# EAGLE design gimbal_controller (EAGLE 7.4.0)
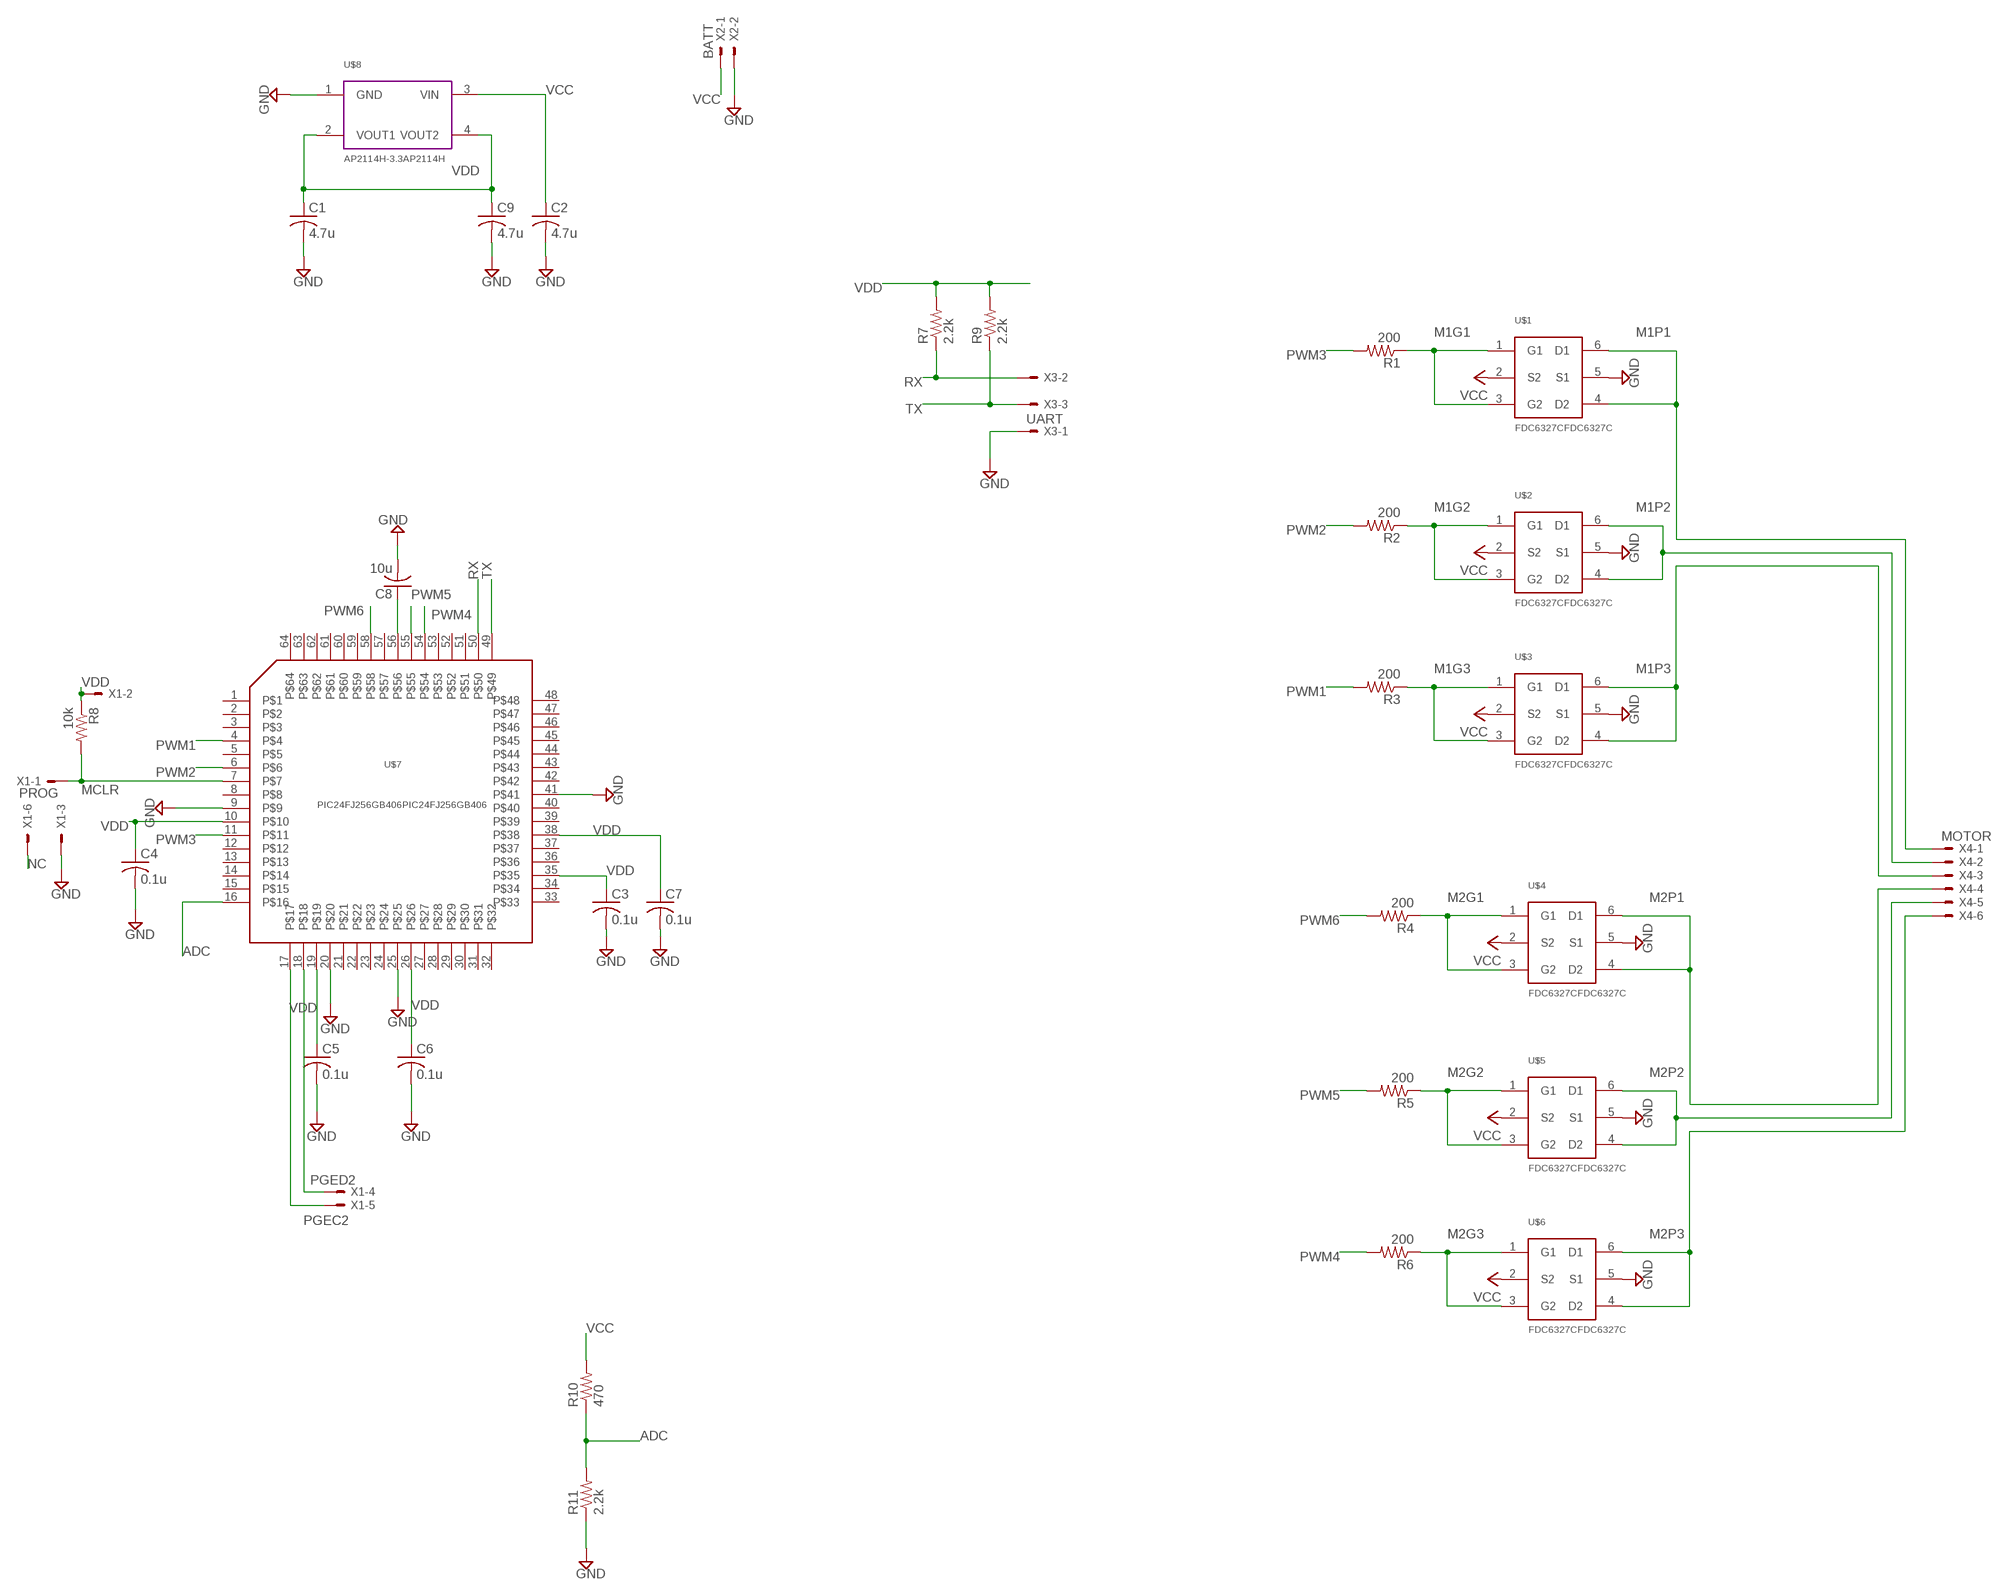
[diagram p0: schematic, sheet 1]

## Parts
C1  4.7u  C-USC0805  [C0805]
C2  4.7u  C-USC0805  [C0805]
C3  0.1u  C-USC0805  [C0805]
C4  0.1u  C-USC0805  [C0805]
C5  0.1u  C-USC0805  [C0805]
C6  0.1u  C-USC0805  [C0805]
C7  0.1u  C-USC0805  [C0805]
C8  10u  C-USC0805  [C0805]
C9  4.7u  C-USC0805  [C0805]
R1  200  R-US_R0805  [R0805]
R2  200  R-US_R0805  [R0805]
R3  200  R-US_R0805  [R0805]
R4  200  R-US_R0805  [R0805]
R5  200  R-US_R0805  [R0805]
R6  200  R-US_R0805  [R0805]
R7  2.2k  R-US_R0805  [R0805]
R8  10k  R-US_R0805  [R0805]
R9  2.2k  R-US_R0805  [R0805]
R10  470  R-US_R0805  [R0805]
R11  2.2k  R-US_R0805  [R0805]
U$1  FDC6327CFDC6327C  [SSOT6]
U$2  FDC6327CFDC6327C  [SSOT6]
U$3  FDC6327CFDC6327C  [SSOT6]
U$4  FDC6327CFDC6327C  [SSOT6]
U$5  FDC6327CFDC6327C  [SSOT6]
U$6  FDC6327CFDC6327C  [SSOT6]
U$7  PIC24FJ256GB406PIC24FJ256GB406  [TQFP64-10X10]
U$8  AP2114H-3.3AP2114H  [SOT223]
X1  PROG  22-23-2061  [22-23-2061]
X2  BATT  22-23-2021  [22-23-2021]
X3  UART  22-23-2031  [22-23-2031]
X4  MOTOR  22-23-2061  [22-23-2061]

## Nets
ADC: R10.1 R11.2 U$7.16
GND: C1.2 C2.2 C3.2 C4.2 C5.2 C6.2 C7.2 C8.2 C9.2 R11.1 U$1.5(S1) U$2.5(S1) U$3.5(S1) U$4.5(S1) U$5.5(S1) U$6.5(S1) U$7.9 U$7.20 U$7.25 U$7.41 U$8.1(GND) X1.3 X2.2 X3.1
M1G1: R1.1 U$1.1(G1) U$1.3(G2)
M1G2: R2.1 U$2.1(G1) U$2.3(G2)
M1G3: R3.1 U$3.1(G1) U$3.3(G2)
M1P1: U$1.4(D2) U$1.6(D1) X4.1
M1P2: U$2.4(D2) U$2.6(D1) X4.2
M1P3: U$3.4(D2) U$3.6(D1) X4.3
M2G1: R4.1 U$4.1(G1) U$4.3(G2)
M2G2: R5.1 U$5.1(G1) U$5.3(G2)
M2G3: R6.1 U$6.1(G1) U$6.3(G2)
M2P1: U$4.4(D2) U$4.6(D1) X4.4
M2P2: U$5.4(D2) U$5.6(D1) X4.5
M2P3: U$6.4(D2) U$6.6(D1) X4.6
MCLR: R8.2 U$7.7 X1.1
N$3: C8.1 U$7.56
NC: X1.6
PGEC2: U$7.17 X1.5
PGED2: U$7.18 X1.4
PWM1: R3.2 U$7.4
PWM2: R2.2 U$7.6
PWM3: R1.2 U$7.11
PWM4: R6.2 U$7.54
PWM5: R5.2 U$7.55
PWM6: R4.2 U$7.58
RX: R7.1 U$7.50 X3.2
TX: R9.1 U$7.49 X3.3
VCC: C2.1 R10.2 U$1.2(S2) U$2.2(S2) U$3.2(S2) U$4.2(S2) U$5.2(S2) U$6.2(S2) U$8.3(VIN) X2.1
VDD: C1.1 C3.1 C4.1 C5.1 C6.1 C7.1 C9.1 R7.2 R8.1 R9.2 U$7.10 U$7.19 U$7.26 U$7.35 U$7.38 U$8.2(VOUT1) U$8.4(VOUT2) X1.2
Unconnected: U$7.1 U$7.2 U$7.3 U$7.5 U$7.8 U$7.12 U$7.13 U$7.14 U$7.15 U$7.21 U$7.22 U$7.23 U$7.24 U$7.27 U$7.28 U$7.29 U$7.30 U$7.31 U$7.32 U$7.33 U$7.34 U$7.36 U$7.37 U$7.39 U$7.40 U$7.42 U$7.43 U$7.44 U$7.45 U$7.46 U$7.47 U$7.48 U$7.51 U$7.52 U$7.53 U$7.57 U$7.59 U$7.60 U$7.61 U$7.62 U$7.63 U$7.64

## Library data of the parts
C1-C9 = resistor:C-US: CAPACITOR, American symbol
R1-R6 R8 = rcl:R-US_: RESISTOR, American symbol
R7 R9-R11 = resistor:R-US_: RESISTOR, American symbol
U$1-U$6 = transistors:FDC6327C: MOSFET N/P HALFBRIDGE; DIGIKEY_PARTNO: FDC6327CCT-ND
U$7 = mcu:PIC24FJ256GB406; DIGIKEY_PARTNO: PIC24FJ256GB406-I/PT-ND
U$8 = power:AP2114H-3.3: IC REG LDO 3.3V 1A SOT223; DIGIKEY_PARTNO: AP2114H-3.3TRG1DICT-ND
X1 X4 = con-molex:22-23-2061: .100" (2.54mm) Center Header - 6 Pin; MF: MOLEX; MPN: 22-23-2061; OC_FARNELL: 1462922; OC_NEWARK: 27C1933
X2 = con-molex:22-23-2021: .100" (2.54mm) Center Header - 2 Pin; MF: MOLEX; MPN: 22-23-2021; OC_FARNELL: 1462926; OC_NEWARK: 25C3832
X3 = con-molex:22-23-2031: .100" (2.54mm) Center Header - 3 Pin; MF: MOLEX; MPN: 22-23-2031; OC_FARNELL: 1462950; OC_NEWARK: 30C0862

## Board
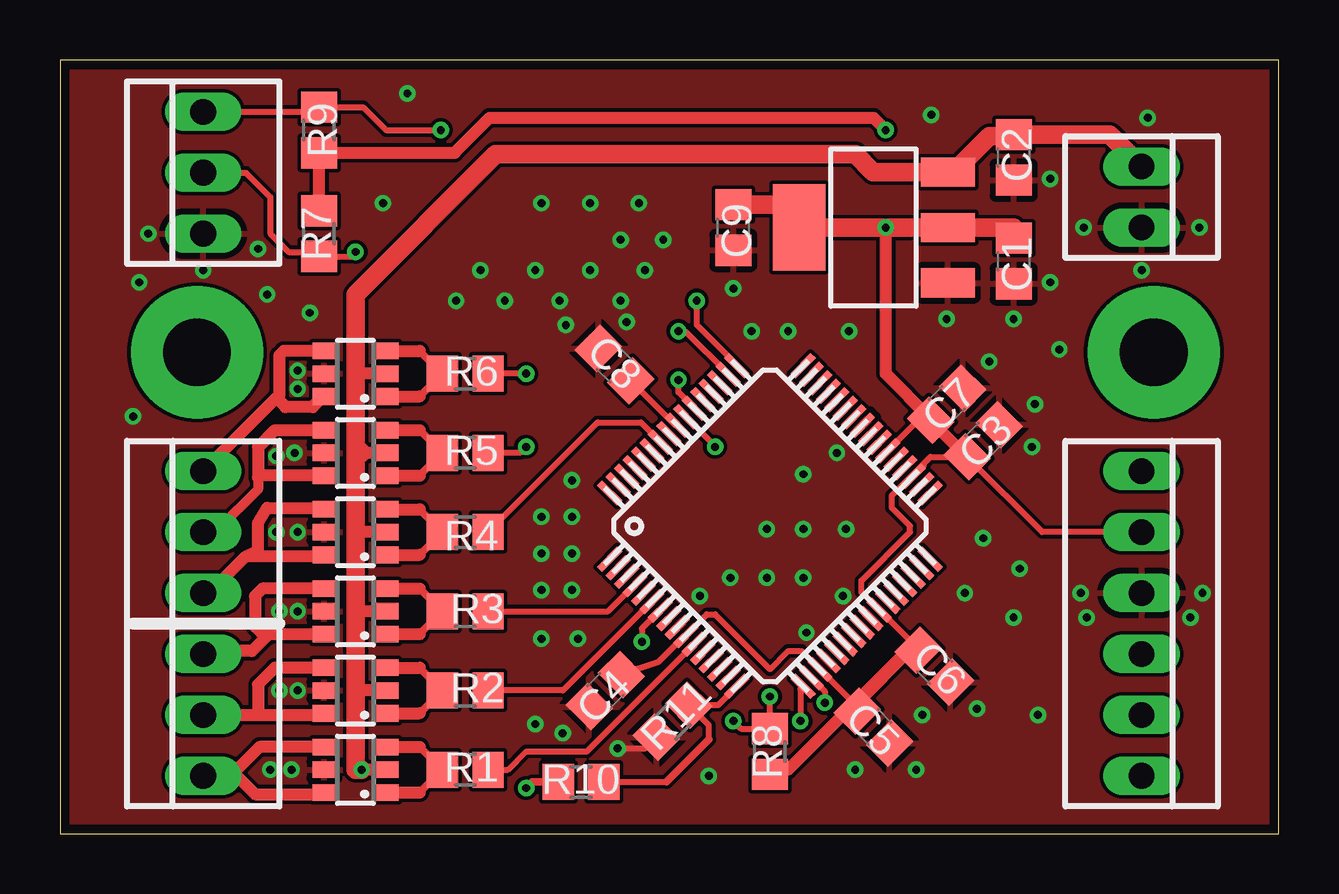
[diagram p1: board, top side]
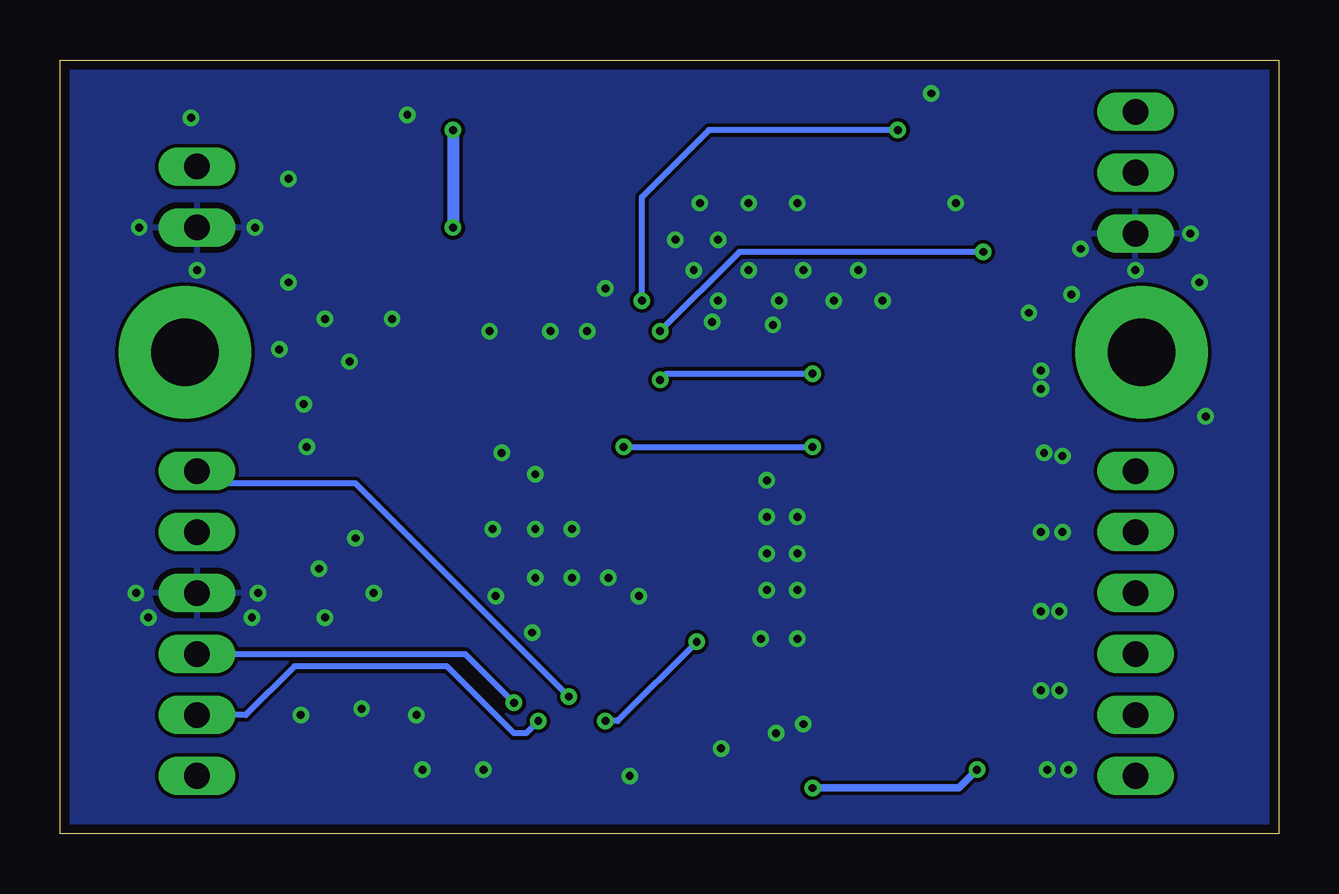
[diagram p2: board, bottom side, seen from below]

Size 50.8 x 32.26 mm. Coordinates in mm from the lower left corner, seen from the top.
Outline: 0,0 50.8,0 50.8,32.26 0,32.26 0,0
Copper layers (1*16): Top 0.0356mm / dielectric 1.5011mm / Bottom 0.0356mm
Design rules "LaenPCBOrder": minimum track width 6mil, minimum drill 13mil, track to track 6mil, track to pad 6mil, pad to pad 6mil, via to via 6mil, smd to smd 6mil, copper to edge 15mil, drill to drill 6mil, minimum pad ring 7mil, minimum via ring 7mil, stop-mask expansion 3mil, vias tented up to drill 0mil, thermal gap 10mil

### Footprints (pad centres in the part's own frame; a part is rotated, then mirrored left to right if it is on the bottom)
C0805 = smd 1.3 x 1.5: 1 -0.95,0; 2 0.95,0
R0805 = smd 1.3 x 1.5: 1 -0.95,0; 2 0.95,0
SSOT6 = smd 0.69 x 0.99: 1 -0.95,-1.3; 2 0,-1.3; 3 0.95,-1.3; 4 0.95,1.3; 5 0,1.3; 6 -0.95,1.3
TQFP64-10X10 = smd 1.2 x 0.3: 1 -5.7,3.75; 2 -5.7,3.25; 3 -5.7,2.75; 4 -5.7,2.25; 5 -5.7,1.75; 6 -5.7,1.25; 7 -5.7,0.75; 8 -5.7,0.25; 9 -5.7,-0.25; 10 -5.7,-0.75; 11 -5.7,-1.25; 12 -5.7,-1.75; 13 -5.7,-2.25; 14 -5.7,-2.75; 15 -5.7,-3.25; 16 -5.7,-3.75; 33 5.7,-3.75; 34 5.7,-3.25; 35 5.7,-2.75; 36 5.7,-2.25; 37 5.7,-1.75; 38 5.7,-1.25; 39 5.7,-0.75; 40 5.7,-0.25; 41 5.7,0.25; 42 5.7,0.75; 43 5.7,1.25; 44 5.7,1.75; 45 5.7,2.25; 46 5.7,2.75; 47 5.7,3.25; 48 5.7,3.75 | smd 0.3 x 1.2: 17 -3.75,-5.7; 18 -3.25,-5.7; 19 -2.75,-5.7; 20 -2.25,-5.7; 21 -1.75,-5.7; 22 -1.25,-5.7; 23 -0.75,-5.7; 24 -0.25,-5.7; 25 0.25,-5.7; 26 0.75,-5.7; 27 1.25,-5.7; 28 1.75,-5.7; 29 2.25,-5.7; 30 2.75,-5.7; 31 3.25,-5.7; 32 3.75,-5.7; 49 3.75,5.7; 50 3.25,5.7; 51 2.75,5.7; 52 2.25,5.7; 53 1.75,5.7; 54 1.25,5.7; 55 0.75,5.7; 56 0.25,5.7; 57 -0.25,5.7; 58 -0.75,5.7; 59 -1.25,5.7; 60 -1.75,5.7; 61 -2.25,5.7; 62 -2.75,5.7; 63 -3.25,5.7; 64 -3.75,5.7
SOT223 = smd 1.219 x 2.235: 1 -2.311,-3.099; 2 0,-3.099; 3 2.311,-3.099 | smd 3.6 x 2.2: 4 0,3.099
22-23-2061 = drill 1.067 long: 1 -6.35,0; 2 -3.81,0; 3 -1.27,0; 4 1.27,0; 5 3.81,0; 6 6.35,0
22-23-2021 = drill 1.067 long: 1 -1.27,0; 2 1.27,0
22-23-2031 = drill 1.067 long: 1 -2.54,0; 2 0,0; 3 2.54,0

### Placement (x,y rotation side)
C1  39.75,23.88 270 top
C2  39.75,28.19 270 top
C3  38.48,16.38 45 top
C4  22.73,5.97 225 top
C5  33.91,4.45 315 top
C6  36.45,6.99 315 top
C7  36.96,17.91 45 top
C8  23.11,19.56 135 top
C9  28.07,25.27 270 top
R1  16.89,2.67 0 top
R2  16.89,5.97 0 top
R3  16.89,9.27 0 top
R4  16.89,12.57 0 top
R5  16.89,15.88 0 top
R6  16.89,19.18 0 top
R7  10.79,25.02 90 top
R8  29.59,3.43 90 top
R9  10.79,29.34 270 top
R10  21.72,2.16 180 top
R11  25.53,4.7 45 top
U$1  12.32,2.67 90 top
U$2  12.32,5.97 90 top
U$3  12.32,9.27 90 top
U$4  12.32,12.57 90 top
U$5  12.32,15.88 90 top
U$6  12.32,19.18 90 top
U$7  29.59,12.83 45 top
U$8  33.91,25.27 90 top
X1  45.09,8.76 270 top
X2  45.09,26.54 270 top
X3  5.97,27.56 90 top
X4  5.97,8.76 90 top

### Tracks (layer width: path | path; a pad name or v marks a point on that pad's centre or on a via)
ADC
  Top 0.254: R10.1 25.27,2.16 | 27.05,3.94 27.05,4.52 R11.2 27.44,5.37 U$7.16
  Top 0.305: 25.27,2.16 27.05,3.94
GND  (via drill 0.33, 0.33 pad 0.3)
  Top 0.254: v23.24,3.56 24.38,3.56 R11.1
  other vias: 40.51,16.13 38.73,19.68 32.38,15.88 20.95,4.19 35.69,2.67 38.23,5.21 21.08,21.21 23.62,21.34 9.91,19.3 9.91,18.54 9.02,15.75 9.78,15.88 9.02,12.57 9.91,12.57 8.76,2.67 9.65,2.67 9.14,5.97 9.91,5.97 9.14,9.27 9.91,9.27 40.64,17.91 42.55,10.03 42.8,9.02 47.12,9.02 47.62,10.03 3.68,25.02 8.26,24.38 5.97,23.5 28.07,22.73 36.96,21.46 39.75,21.46 41.27,22.99 41.27,27.3 42.67,25.27 45.09,23.5 47.5,25.27 20.07,26.29 22.1,26.29 24.13,26.29 23.37,24.77 25.15,24.77 17.53,23.5 19.81,23.5 22.1,23.5 24.38,23.5 16.51,22.23 18.54,22.23 20.83,22.23 23.37,22.23 21.34,14.73 21.34,13.21 21.34,11.68 21.34,10.16 20.07,13.21 20.07,11.68 20.07,10.16 29.46,12.7 30.99,14.99 30.99,12.7 27.94,10.67 29.46,10.67 30.99,10.67 32.77,12.7 8.64,22.48 10.41,21.72 3.3,22.99 3.05,17.4 13.46,26.29 36.32,29.97 45.34,29.84 41.66,20.19 38.48,12.32 37.72,10.03 40.01,11.05 39.75,9.02 21.59,8.13 20.07,8.13 19.81,4.57 33.15,2.67 35.94,4.95 40.77,4.95 27.05,2.41 32.89,20.95 30.35,20.95 28.83,20.95 14.48,30.86 26.67,9.91 31.11,8.38 32.64,9.91
  pour Top: 0,32.26 50.8,32.26 50.8,0 0,0
  pour Bottom: 0,32.26 50.8,32.26 50.8,0 0,0
M1G1
  Top 0.305: 14.99,1.72 R1.1 14.99,3.62
  Top 0.508: U$1.1 14.99,1.72 | U$1.3 14.99,3.62
M1G2
  Top 0.305: 14.99,5.02 R2.1 14.99,6.92
  Top 0.508: U$2.1 14.99,5.02 | U$2.3 14.99,6.92
M1G3
  Top 0.305: 14.99,8.32 R3.1 14.99,10.22
  Top 0.508: U$3.1 14.99,8.32 | U$3.3 14.99,10.22
M1P1
  Top 0.508: X4.1 7.11,2.41 | 7.11,2.41 7.37,2.41 8.13,1.65 10.95,1.65 U$1.6 | 7.11,2.41 8.32,3.62 U$1.4
M1P2
  Top 0.508: X4.2 8.13,4.95 | 8.13,4.95 10.95,4.95 U$2.6 | 8.13,4.95 8.26,5.08 8.26,6.22 8.95,6.92 U$2.4
M1P3
  Top 0.508: 8.57,8.19 8.7,8.32 U$3.6 | 8.57,8.19 8,7.62 6.1,7.62 X4.3 | 8.57,8.19 8.13,8.64 8.13,9.91 8.44,10.22 U$3.4
M2G1
  Top 0.305: 14.99,13.52 R4.1 14.99,11.62
  Top 0.508: U$4.1 14.99,11.62 | U$4.3 14.99,13.52
M2G2
  Top 0.305: 14.99,14.93 R5.1 14.99,16.82
  Top 0.508: U$5.1 14.99,14.93 | U$5.3 14.99,16.82
M2G3
  Top 0.305: 14.99,18.23 R6.1 14.99,20.13
  Top 0.508: U$6.1 14.99,18.23 | U$6.3 14.99,20.13
M2P1
  Top 0.508: X4.4 6.22,10.03 7.75,11.56 | 7.75,11.56 8.26,11.81 8.26,12.95 8.64,13.59 10.95,13.59 U$4.4 | U$4.6 10.95,11.56 7.75,11.56
M2P2
  Top 0.406: 8.26,14.86 8.26,14.35 6.6,12.7 6.1,12.7 X4.5
  Top 0.508: U$5.4 8.95,16.82 8.26,16.13 8.26,14.86 8.32,14.93 U$5.6
M2P3
  Top 0.508: 9.02,18.16 9.14,18.29 9.14,19.94 9.33,20.13 U$6.4 | 9.02,18.16 X4.6 | 9.02,18.16 9.4,17.78 10.54,17.78 10.99,18.23 U$6.6
MCLR  (via drill 0.33)
  Top 0.254: v24.26,8 24.26,8.55 U$7.7 | v28.07,4.7 28.39,4.38 R8.2 v29.59,5.71
  Bottom 0.254: v24.26,8 27.56,4.7 v28.07,4.7 | v29.59,5.71 38.48,14.61 44.58,14.61 X1.1
N$1  (via drill 2.82 pad 5.51)
  other vias: 45.59,20.07
N$2  (via drill 2.82 pad 5.51)
  other vias: 5.71,20.07
N$3
  Top 0.254: 23.5,19.27 C8.1 25.64,17.03 U$7.56
PGEC2  (via drill 0.33)
  Top 0.254: v30.86,4.7 30.86,6.04 U$7.17
  Bottom 0.254: v30.86,4.7 31.37,4.19 31.88,4.19 34.67,6.99 41.02,6.99 43.05,4.95 X1.5
PGED2  (via drill 0.33)
  Top 0.254: v31.88,5.46 31.88,5.95 U$7.18
  Bottom 0.254: X1.4 33.91,7.49 v31.88,5.46
PWM1
  Top 0.254: R3.2 22.85,9.27 U$7.4
PWM2
  Top 0.254: R2.2 20.96,5.97 U$7.6
PWM3
  Top 0.254: R1.2 18.67,2.67 19.43,3.43 21.96,3.43 U$7.11
PWM4  (via drill 0.33)
  Top 0.254: v25.78,18.92 25.78,18.41 U$7.54 | v19.43,19.18 R6.2
  Bottom 0.254: v25.78,18.92 25.53,19.18 v19.43,19.18
PWM5  (via drill 0.33)
  Top 0.254: v27.3,16.13 27.3,16.17 U$7.55 | v19.43,16.13 19.18,15.88 R5.2
  Bottom 0.254: v27.3,16.13 v19.43,16.13
PWM6
  Top 0.254: R4.2 22.41,17.14 24.21,17.14 U$7.58
RX  (via drill 0.33 pad 0.3)
  Top 0.254: X3.2 7.75,27.56 8.76,26.54 8.76,25.02 9.53,24.26 10.61,24.26 R7.1 12.13,24.07 v12.32,24.26 | v25.78,20.95 26.06,20.95 U$7.50
  Bottom 0.254: v12.32,24.26 22.48,24.26 v25.78,20.95
TX  (via drill 0.33 pad 0.3)
  Top 0.254: X3.3 10.61,30.1 R9.1 12.64,30.29 13.59,29.34 v15.88,29.34 | v26.54,22.23 26.54,21.21 28.19,19.56 | 28.19,19.56 28.21,19.54 | U$7.49 28.19,19.53 28.19,19.56
  Bottom 0.254: v15.88,29.34 23.75,29.34 26.54,26.54 v26.54,22.23
VCC  (via drill 0.33 pad 0.3)
  Top 0.254: U$8.3 37.24,27.58
  Top 0.305: R10.2 19.68,2.16 v19.43,1.91
  Top 0.508: U$2.2 12.32,5.97 | U$1.2 v12.57,2.67 | U$3.2 12.32,9.27 | U$6.2 12.32,19.18 | U$5.2 12.57,15.88 | U$4.2 12.32,12.57
  Top 0.762: 37.24,27.58 38.73,29.08 39.69,29.08 C2.1 43.75,29.14 X2.1 | 12.32,16.13 12.32,19.18 12.32,22.48 18.16,28.32 33.15,28.32 33.88,27.58 U$8.3 | 12.32,16.13 12.32,12.57 12.32,9.27 12.32,5.97 12.32,2.67 v12.57,2.67 | 12.57,15.88 12.32,16.13
  Bottom 0.305: v19.43,1.91 13.34,1.91 v12.57,2.67
VDD  (via drill 0.33 pad 0.3)
  Top 0.254: C4.1 24.93,7.15 26.05,8.27 U$7.10 26.97,9.14 27.3,9.14 29.59,6.86 30.35,7.62 30.91,7.62 U$7.19 33.24,5.29 | 33.24,5.29 35.6,7.66 C6.1 35.78,7.7 U$7.26 33.4,10.08 33.4,10.54 35.43,12.57 35.43,12.83 34.67,13.59 34.67,14.1 36.01,15.43 | C7.1 35.77,17.23 U$7.38 | 36.01,15.43 36.28,15.71 C3.1 40.95,12.57 X1.2 | 33.24,5.29 C5.1 | U$7.35 36.01,15.35 36.01,15.43
  Top 0.508: R8.1 29.78,2.67 30.35,2.67 35.34,7.66 C6.1 | C3.1 C7.1 36.28,17.31 34.42,19.18 v34.42,25.27 | v34.42,29.34 33.91,29.84 17.91,29.84 16.45,28.39 R9.2 R7.2
  Top 0.762: C9.1 30.81,26.22 U$8.4 v34.42,25.27 U$8.2 39.75,25.27 C1.1
  Bottom 0.508: v34.42,29.34 v34.42,25.27

### Text on the board
tStop: www.quadcopter.logike.se | UART | BATT | M2 | PIC24FJ | PROG | M1
bStop: QG1624